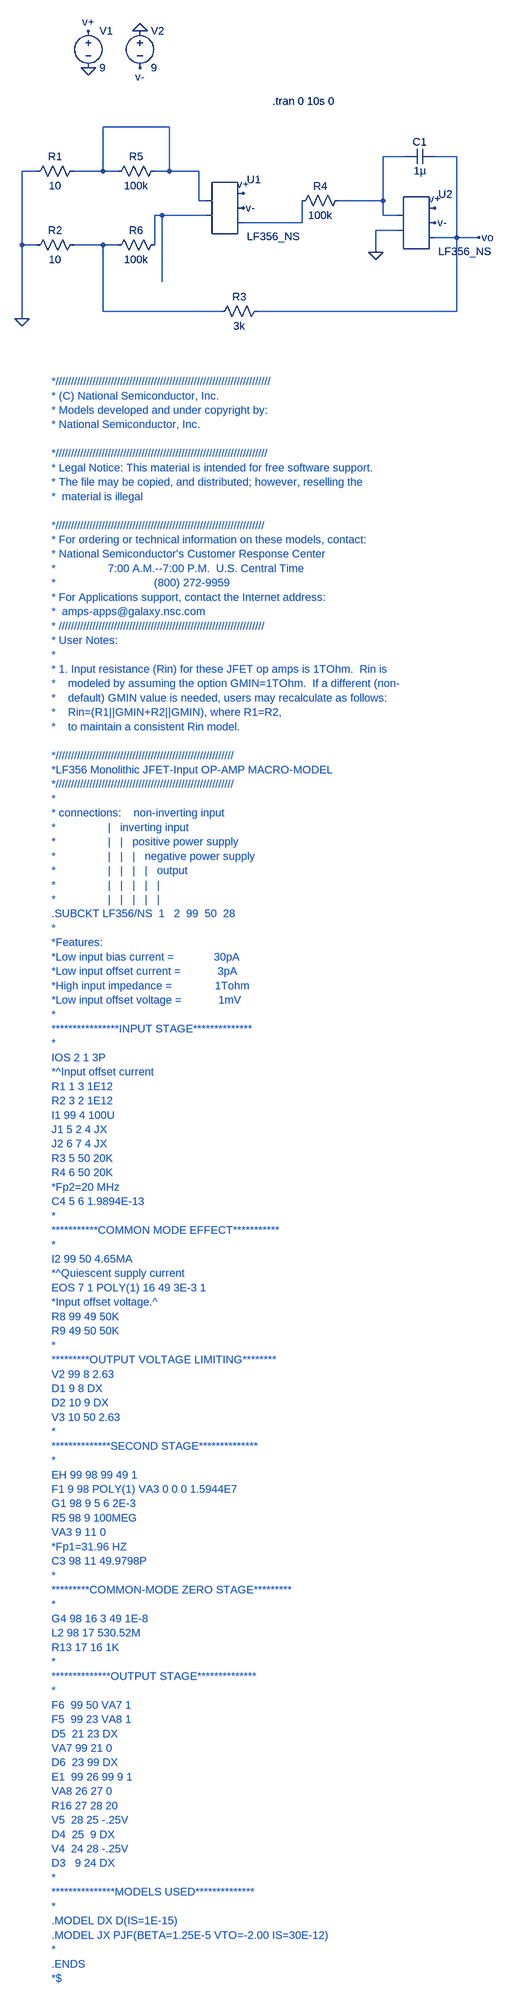
[diagram p0: schematic Ej2.asc]
Ej2.asc, the LTspice schematic file:
Version 4
SHEET 1 1100 3708
WIRE 384 32 240 32
WIRE 896 96 848 96
WIRE 1008 96 960 96
WIRE 96 128 64 128
WIRE 240 128 240 32
WIRE 240 128 176 128
WIRE 272 128 240 128
WIRE 384 128 384 32
WIRE 384 128 352 128
WIRE 448 128 384 128
WIRE 448 192 448 128
WIRE 464 192 448 192
WIRE 848 192 848 96
WIRE 848 192 752 192
WIRE 368 224 352 224
WIRE 464 224 368 224
WIRE 848 224 848 192
WIRE 880 224 848 224
WIRE 672 240 672 192
WIRE 672 240 544 240
WIRE 880 256 832 256
WIRE 1008 272 1008 96
WIRE 1008 272 960 272
WIRE 1056 272 1008 272
WIRE 64 288 64 128
WIRE 96 288 64 288
WIRE 240 288 176 288
WIRE 272 288 240 288
WIRE 352 288 352 224
WIRE 832 304 832 256
WIRE 368 368 368 224
WIRE 240 432 240 288
WIRE 496 432 240 432
WIRE 1008 432 1008 272
WIRE 1008 432 576 432
WIRE 64 448 64 288
FLAG 832 304 0
FLAG 64 448 0
FLAG 208 -96 0
FLAG 320 -176 0
FLAG 208 -176 v+
FLAG 544 176 v+
FLAG 960 208 v+
FLAG 320 -96 v-
FLAG 544 208 v-
FLAG 960 240 v-
FLAG 1056 272 vo
SYMBOL res 192 112 R90
WINDOW 0 0 56 VBottom 2
WINDOW 3 32 56 VTop 2
SYMATTR InstName R1
SYMATTR Value 10
SYMBOL res 192 272 R90
WINDOW 0 0 56 VBottom 2
WINDOW 3 32 56 VTop 2
SYMATTR InstName R2
SYMATTR Value 10
SYMBOL res 592 416 R90
WINDOW 0 0 56 VBottom 2
WINDOW 3 32 56 VTop 2
SYMATTR InstName R3
SYMATTR Value 3k
SYMBOL res 768 176 R90
WINDOW 0 0 56 VBottom 2
WINDOW 3 32 56 VTop 2
SYMATTR InstName R4
SYMATTR Value 100k
SYMBOL res 368 112 R90
WINDOW 0 0 56 VBottom 2
WINDOW 3 32 56 VTop 2
SYMATTR InstName R5
SYMATTR Value 100k
SYMBOL res 368 272 R90
WINDOW 0 0 56 VBottom 2
WINDOW 3 32 56 VTop 2
SYMATTR InstName R6
SYMATTR Value 100k
SYMBOL cap 960 80 R90
WINDOW 0 0 32 VBottom 2
WINDOW 3 32 32 VTop 2
SYMATTR InstName C1
SYMATTR Value 1µ
SYMBOL voltage 208 -192 R0
WINDOW 123 0 0 Left 0
WINDOW 39 0 0 Left 0
SYMATTR InstName V1
SYMATTR Value 9
SYMBOL voltage 320 -192 R0
WINDOW 123 0 0 Left 0
WINDOW 39 0 0 Left 0
SYMATTR InstName V2
SYMATTR Value 9
SYMBOL AutoGenerated\\LF356_NS 496 208 R0
SYMATTR InstName U1
SYMBOL AutoGenerated\\LF356_NS 912 240 R0
SYMATTR InstName U2
TEXT 128 584 Left 2 ;*//////////////////////////////////////////////////////////////////////\n* (C) National Semiconductor, Inc.\n* Models developed and under copyright by:\n* National Semiconductor, Inc.  \n \n*/////////////////////////////////////////////////////////////////////\n* Legal Notice: This material is intended for free software support.\n* The file may be copied, and distributed; however, reselling the \n*  material is illegal\n \n*////////////////////////////////////////////////////////////////////\n* For ordering or technical information on these models, contact:\n* National Semiconductor's Customer Response Center\n*                 7:00 A.M.--7:00 P.M.  U.S. Central Time\n*                                (800) 272-9959\n* For Applications support, contact the Internet address:\n*  amps-apps@galaxy.nsc.com\n* ///////////////////////////////////////////////////////////////////\n* User Notes:\n*\n* 1. Input resistance (Rin) for these JFET op amps is 1TOhm.  Rin is\n*    modeled by assuming the option GMIN=1TOhm.  If a different (non-\n*    default) GMIN value is needed, users may recalculate as follows:\n*    Rin=(R1||GMIN+R2||GMIN), where R1=R2,\n*    to maintain a consistent Rin model.\n \n*//////////////////////////////////////////////////////////\n*LF356 Monolithic JFET-Input OP-AMP MACRO-MODEL\n*//////////////////////////////////////////////////////////\n*\n* connections:    non-inverting input\n*                 |   inverting input\n*                 |   |   positive power supply\n*                 |   |   |   negative power supply\n*                 |   |   |   |   output\n*                 |   |   |   |   |\n*                 |   |   |   |   |\n.SUBCKT LF356/NS  1   2  99  50  28\n*\n*Features:\n*Low input bias current =             30pA\n*Low input offset current =            3pA\n*High input impedance =              1Tohm\n*Low input offset voltage =            1mV\n*\n****************INPUT STAGE************** \n*\nIOS 2 1 3P\n*^Input offset current\nR1 1 3 1E12\nR2 3 2 1E12\nI1 99 4 100U\nJ1 5 2 4 JX\nJ2 6 7 4 JX\nR3 5 50 20K\nR4 6 50 20K\n*Fp2=20 MHz\nC4 5 6 1.9894E-13\n*\n***********COMMON MODE EFFECT***********\n*\nI2 99 50 4.65MA\n*^Quiescent supply current\nEOS 7 1 POLY(1) 16 49 3E-3 1\n*Input offset voltage.^\nR8 99 49 50K\nR9 49 50 50K\n*\n*********OUTPUT VOLTAGE LIMITING********\nV2 99 8 2.63\nD1 9 8 DX\nD2 10 9 DX\nV3 10 50 2.63\n*\n**************SECOND STAGE**************\n*\nEH 99 98 99 49 1\nF1 9 98 POLY(1) VA3 0 0 0 1.5944E7\nG1 98 9 5 6 2E-3\nR5 98 9 100MEG\nVA3 9 11 0\n*Fp1=31.96 HZ\nC3 98 11 49.9798P\n*\n*********COMMON-MODE ZERO STAGE*********\n*\nG4 98 16 3 49 1E-8\nL2 98 17 530.52M\nR13 17 16 1K\n*\n**************OUTPUT STAGE**************\n*\nF6  99 50 VA7 1\nF5  99 23 VA8 1\nD5  21 23 DX\nVA7 99 21 0\nD6  23 99 DX\nE1  99 26 99 9 1\nVA8 26 27 0\nR16 27 28 20\nV5  28 25 -.25V\nD4  25  9 DX\nV4  24 28 -.25V\nD3   9 24 DX\n*\n***************MODELS USED**************\n*\n.MODEL DX D(IS=1E-15)\n.MODEL JX PJF(BETA=1.25E-5 VTO=-2.00 IS=30E-12)\n*\n.ENDS\n*$
TEXT 608 -24 Left 2 !.tran 0 10s 0

The netlist it stands for:
* Ej2.asc
R1 N001 0 10
R2 N005 0 10
R3 vo N005 3k
R4 N002 N004 100k
R5 N001 N001 100k
R6 N003 N005 100k
C1 vo N002 1µ
V1 v+ 0 9
V2 0 v- 9
* U1: LF356_NS (symbol AutoGenerated\LF356_NS not available, pins judged from their places): pin1=N001 pin2=N003 pin3=v+ pin4=v- pin5=N004
* U2: LF356_NS (symbol AutoGenerated\LF356_NS not available, pins judged from their places): pin1=N002 pin2=0 pin3=v+ pin4=v- pin5=vo
* *//////////////////////////////////////////////////////////////////////
* * (C) National Semiconductor, Inc.
* * Models developed and under copyright by:
* * National Semiconductor, Inc.
* */////////////////////////////////////////////////////////////////////
* * Legal Notice: This material is intended for free software support.
* * The file may be copied, and distributed; however, reselling the
* *  material is illegal
* *////////////////////////////////////////////////////////////////////
* * For ordering or technical information on these models, contact:
* * National Semiconductor's Customer Response Center
* *                 7:00 A.M.--7:00 P.M.  U.S. Central Time
* *                                (800) 272-9959
* * For Applications support, contact the Internet address:
* *  amps-apps@galaxy.nsc.com
* * ///////////////////////////////////////////////////////////////////
* * User Notes:
* *
* * 1. Input resistance (Rin) for these JFET op amps is 1TOhm.  Rin is
* *    modeled by assuming the option GMIN=1TOhm.  If a different (non-
* *    default) GMIN value is needed, users may recalculate as follows:
* *    Rin=(R1||GMIN+R2||GMIN), where R1=R2,
* *    to maintain a consistent Rin model.
* *//////////////////////////////////////////////////////////
* *LF356 Monolithic JFET-Input OP-AMP MACRO-MODEL
* *//////////////////////////////////////////////////////////
* *
* * connections:    non-inverting input
* *                 |   inverting input
* *                 |   |   positive power supply
* *                 |   |   |   negative power supply
* *                 |   |   |   |   output
* *                 |   |   |   |   |
* *                 |   |   |   |   |
* .SUBCKT LF356/NS  1   2  99  50  28
* *
* *Features:
* *Low input bias current =             30pA
* *Low input offset current =            3pA
* *High input impedance =              1Tohm
* *Low input offset voltage =            1mV
* *
* ****************INPUT STAGE**************
* *
* IOS 2 1 3P
* *^Input offset current
* R1 1 3 1E12
* R2 3 2 1E12
* I1 99 4 100U
* J1 5 2 4 JX
* J2 6 7 4 JX
* R3 5 50 20K
* R4 6 50 20K
* *Fp2=20 MHz
* C4 5 6 1.9894E-13
* *
* ***********COMMON MODE EFFECT***********
* *
* I2 99 50 4.65MA
* *^Quiescent supply current
* EOS 7 1 POLY(1) 16 49 3E-3 1
* *Input offset voltage.^
* R8 99 49 50K
* R9 49 50 50K
* *
* *********OUTPUT VOLTAGE LIMITING********
* V2 99 8 2.63
* D1 9 8 DX
* D2 10 9 DX
* V3 10 50 2.63
* *
* **************SECOND STAGE**************
* *
* EH 99 98 99 49 1
* F1 9 98 POLY(1) VA3 0 0 0 1.5944E7
* G1 98 9 5 6 2E-3
* R5 98 9 100MEG
* VA3 9 11 0
* *Fp1=31.96 HZ
* C3 98 11 49.9798P
* *
* *********COMMON-MODE ZERO STAGE*********
* *
* G4 98 16 3 49 1E-8
* L2 98 17 530.52M
* R13 17 16 1K
* *
* **************OUTPUT STAGE**************
* *
* F6  99 50 VA7 1
* F5  99 23 VA8 1
* D5  21 23 DX
* VA7 99 21 0
* D6  23 99 DX
* E1  99 26 99 9 1
* VA8 26 27 0
* R16 27 28 20
* V5  28 25 -.25V
* D4  25  9 DX
* V4  24 28 -.25V
* D3   9 24 DX
* *
* ***************MODELS USED**************
* *
* .MODEL DX D(IS=1E-15)
* .MODEL JX PJF(BETA=1.25E-5 VTO=-2.00 IS=30E-12)
* *
* .ENDS
* *$
.tran 0 10s 0
.backanno
.end